# Altium schematic sheet FerroAudioAmp.SchDoc
size A4
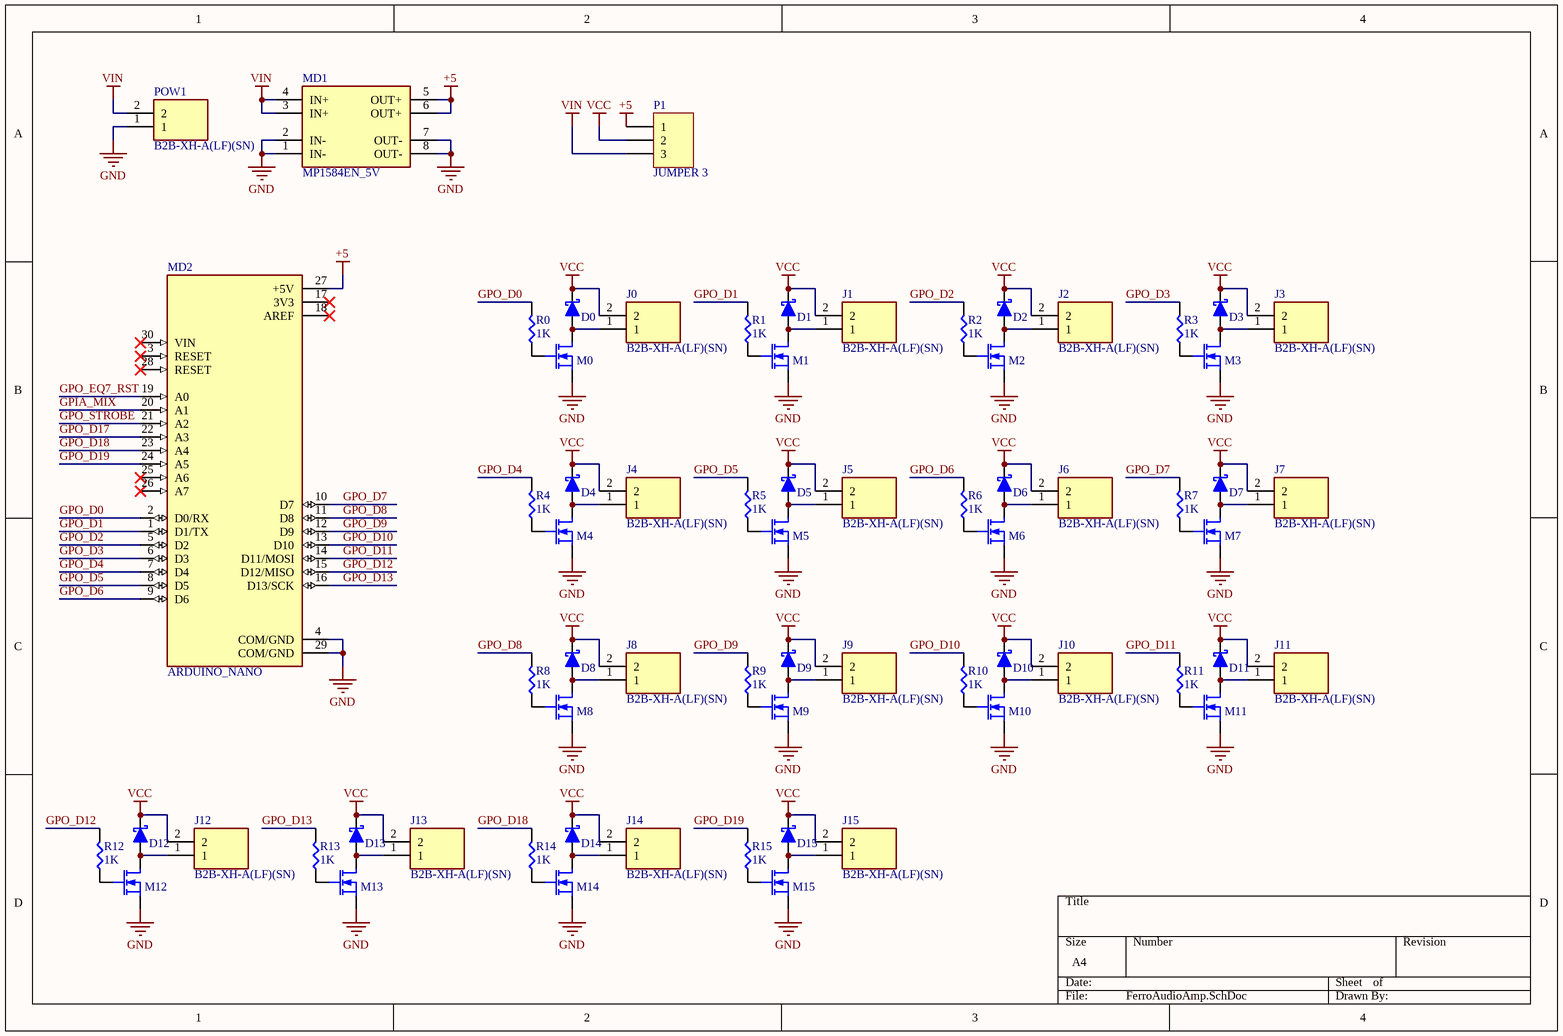
[diagram p0: FerroAudioAmp.SchDoc]

## Parts
D0  RB521S30T1G  [SOD523]  (value not drawn)
D1  RB521S30T1G  [SOD523]  (value not drawn)
D2  RB521S30T1G  [SOD523]  (value not drawn)
D3  RB521S30T1G  [SOD523]  (value not drawn)
D4  RB521S30T1G  [SOD523]  (value not drawn)
D5  RB521S30T1G  [SOD523]  (value not drawn)
D6  RB521S30T1G  [SOD523]  (value not drawn)
D7  RB521S30T1G  [SOD523]  (value not drawn)
D8  RB521S30T1G  [SOD523]  (value not drawn)
D9  RB521S30T1G  [SOD523]  (value not drawn)
D10  RB521S30T1G  [SOD523]  (value not drawn)
D11  RB521S30T1G  [SOD523]  (value not drawn)
D12  RB521S30T1G  [SOD523]  (value not drawn)
D13  RB521S30T1G  [SOD523]  (value not drawn)
D14  RB521S30T1G  [SOD523]  (value not drawn)
D15  RB521S30T1G  [SOD523]  (value not drawn)
J0  B2B-XH-A(LF)(SN)  [JST_B2B-XH-A(LF)(SN)]
J1  B2B-XH-A(LF)(SN)  [JST_B2B-XH-A(LF)(SN)]
J2  B2B-XH-A(LF)(SN)  [JST_B2B-XH-A(LF)(SN)]
J3  B2B-XH-A(LF)(SN)  [JST_B2B-XH-A(LF)(SN)]
J4  B2B-XH-A(LF)(SN)  [JST_B2B-XH-A(LF)(SN)]
J5  B2B-XH-A(LF)(SN)  [JST_B2B-XH-A(LF)(SN)]
J6  B2B-XH-A(LF)(SN)  [JST_B2B-XH-A(LF)(SN)]
J7  B2B-XH-A(LF)(SN)  [JST_B2B-XH-A(LF)(SN)]
J8  B2B-XH-A(LF)(SN)  [JST_B2B-XH-A(LF)(SN)]
J9  B2B-XH-A(LF)(SN)  [JST_B2B-XH-A(LF)(SN)]
J10  B2B-XH-A(LF)(SN)  [JST_B2B-XH-A(LF)(SN)]
J11  B2B-XH-A(LF)(SN)  [JST_B2B-XH-A(LF)(SN)]
J12  B2B-XH-A(LF)(SN)  [JST_B2B-XH-A(LF)(SN)]
J13  B2B-XH-A(LF)(SN)  [JST_B2B-XH-A(LF)(SN)]
J14  B2B-XH-A(LF)(SN)  [JST_B2B-XH-A(LF)(SN)]
J15  B2B-XH-A(LF)(SN)  [JST_B2B-XH-A(LF)(SN)]
M0  DMN2056U-7  [SOT23_L]  (value not drawn)
M1  DMN2056U-7  [SOT23_L]  (value not drawn)
M2  DMN2056U-7  [SOT23_L]  (value not drawn)
M3  DMN2056U-7  [SOT23_L]  (value not drawn)
M4  DMN2056U-7  [SOT23_L]  (value not drawn)
M5  DMN2056U-7  [SOT23_L]  (value not drawn)
M6  DMN2056U-7  [SOT23_L]  (value not drawn)
M7  DMN2056U-7  [SOT23_L]  (value not drawn)
M8  DMN2056U-7  [SOT23_L]  (value not drawn)
M9  DMN2056U-7  [SOT23_L]  (value not drawn)
M10  DMN2056U-7  [SOT23_L]  (value not drawn)
M11  DMN2056U-7  [SOT23_L]  (value not drawn)
M12  DMN2056U-7  [SOT23_L]  (value not drawn)
M13  DMN2056U-7  [SOT23_L]  (value not drawn)
M14  DMN2056U-7  [SOT23_L]  (value not drawn)
M15  DMN2056U-7  [SOT23_L]  (value not drawn)
MD1  MP1584EN_5V  [MP1584EN_5V]
MD2  ARDUINO_NANO  [SHIELD_ARDUINO_NANO]
P1  JUMPER 3  [HDR1X3]
POW1  B2B-XH-A(LF)(SN)  [JST_B2B-XH-A(LF)(SN)]
R0  1K  [0603]
R1  1K  [0603]
R2  1K  [0603]
R3  1K  [0603]
R4  1K  [0603]
R5  1K  [0603]
R6  1K  [0603]
R7  1K  [0603]
R8  1K  [0603]
R9  1K  [0603]
R10  1K  [0603]
R11  1K  [0603]
R12  1K  [0603]
R13  1K  [0603]
R14  1K  [0603]
R15  1K  [0603]

## Nets
+5: MD1.5(OUT+) MD1.6(OUT+) MD2.27(+5V) P1.1
GND: M0.2(S) M1.2(S) M2.2(S) M3.2(S) M4.2(S) M5.2(S) M6.2(S) M7.2(S) M8.2(S) M9.2(S) M10.2(S) M11.2(S) M12.2(S) M13.2(S) M14.2(S) M15.2(S) MD1.1(IN-) MD1.2(IN-) MD1.7(OUT-) MD1.8(OUT-) MD2.4(COM/GND) MD2.29(COM/GND) POW1.1
VCC: D0.C D1.C D2.C D3.C D4.C D5.C D6.C D7.C D8.C D9.C D10.C D11.C D12.C D13.C D14.C D15.C J0.2 J1.2 J2.2 J3.2 J4.2 J5.2 J6.2 J7.2 J8.2 J9.2 J10.2 J11.2 J12.2 J13.2 J14.2 J15.2 P1.2
VIN: MD1.3(IN+) MD1.4(IN+) P1.3 POW1.2
GPIA_MIX: MD2.20(A1)
GPO_D0: MD2.2(D0/RX) R0.2
GPO_D1: MD2.1(D1/TX) R1.2
GPO_D2: MD2.5(D2) R2.2
GPO_D3: MD2.6(D3) R3.2
GPO_D4: MD2.7(D4) R4.2
GPO_D5: MD2.8(D5) R5.2
GPO_D6: MD2.9(D6) R6.2
GPO_D7: MD2.10(D7) R7.2
GPO_D8: MD2.11(D8) R8.2
GPO_D9: MD2.12(D9) R9.2
GPO_D10: MD2.13(D10) R10.2
GPO_D11: MD2.14(D11/MOSI) R11.2
GPO_D12: MD2.15(D12/MISO) R12.2
GPO_D13: MD2.16(D13/SCK) R13.2
GPO_D17: MD2.22(A3)
GPO_D18: MD2.23(A4) R14.2
GPO_D19: MD2.24(A5) R15.2
GPO_EQ7_RST: MD2.19(A0)
GPO_STROBE: MD2.21(A2)
NetD0_A: D0.A J0.1 M0.1(D)
NetD1_A: D1.A J1.1 M1.1(D)
NetD2_A: D2.A J2.1 M2.1(D)
NetD3_A: D3.A J3.1 M3.1(D)
NetD4_A: D4.A J4.1 M4.1(D)
NetD5_A: D5.A J5.1 M5.1(D)
NetD6_A: D6.A J6.1 M6.1(D)
NetD7_A: D7.A J7.1 M7.1(D)
NetD8_A: D8.A J8.1 M8.1(D)
NetD9_A: D9.A J9.1 M9.1(D)
NetD10_A: D10.A J10.1 M10.1(D)
NetD11_A: D11.A J11.1 M11.1(D)
NetD12_A: D12.A J12.1 M12.1(D)
NetD13_A: D13.A J13.1 M13.1(D)
NetD14_A: D14.A J14.1 M14.1(D)
NetD15_A: D15.A J15.1 M15.1(D)
NetM0_3: M0.3(G) R0.1
NetM1_3: M1.3(G) R1.1
NetM2_3: M2.3(G) R2.1
NetM3_3: M3.3(G) R3.1
NetM4_3: M4.3(G) R4.1
NetM5_3: M5.3(G) R5.1
NetM6_3: M6.3(G) R6.1
NetM7_3: M7.3(G) R7.1
NetM8_3: M8.3(G) R8.1
NetM9_3: M9.3(G) R9.1
NetM10_3: M10.3(G) R10.1
NetM11_3: M11.3(G) R11.1
NetM12_3: M12.3(G) R12.1
NetM13_3: M13.3(G) R13.1
NetM14_3: M14.3(G) R14.1
NetM15_3: M15.3(G) R15.1

Not connected (* = marked no-connect by the designer): MD2 3(RESET)* 17(3V3)* 18(AREF)* 25(A6)* 26(A7)* 28(RESET)* 30(VIN)*

## Library data of the parts
D0-D15 = Diode Schottky: Diode Schottky 30V 200mA (DC) Surface Mount SOD-523
J0-J15 POW1 = B2B-XH-A(LF)(SN): Connector Header Through Hole 2 position 0.098 (2.50mm); MF: JST Sales; Value: *; Check_prices: https://www.snapeda.com/parts/B2B-XH-A(LF)(SN)/JST%20Sales%20America%20Inc./view-part/492310/?ref=eda; MP: B2B-XH-A(LF)(SN); Price: None; Package: None; Availability: In Stock; SnapEDA_Link: https://www.snapeda.com/parts/B2B-XH-A(LF)(SN)/JST%20Sales%20America%20Inc./view-part/492310/?ref=snap
M0-M15 = MOSFET-N: N-Channel 20V 4A (Ta) 940mW Surface Mount SOT-23-3
MD1 = MP1584EN_5V: DC-DC 6.5-28V in 5V out module
MD2 = ARDUINO_NANO: ATSAMD21G18A Arduino Nano 33 IoT SAM D ARMÂ® CortexÂ®-M0+ MCU 32-Bit Embedded Evaluation Board; MP: ARDUINO NANO; Package: None; Price: None; Availability: Unavailable; Value: *; MF: Arduino; SnapEDA_Link: https://www.snapeda.com/parts/ARDUINO%20NANO/Arduino/view-part/1128261/?ref=snap
P1 = Header 3: Header, 3-Pin; LatestRevisionDate: 17-Jul-2002; LatestRevisionNote: Re-released for DXP Platform.; Publisher: Altium Limited
R0-R15 = Res: value: 1K